# EAGLE design Easycheck_rev2_chip (EAGLE 9.4.0)
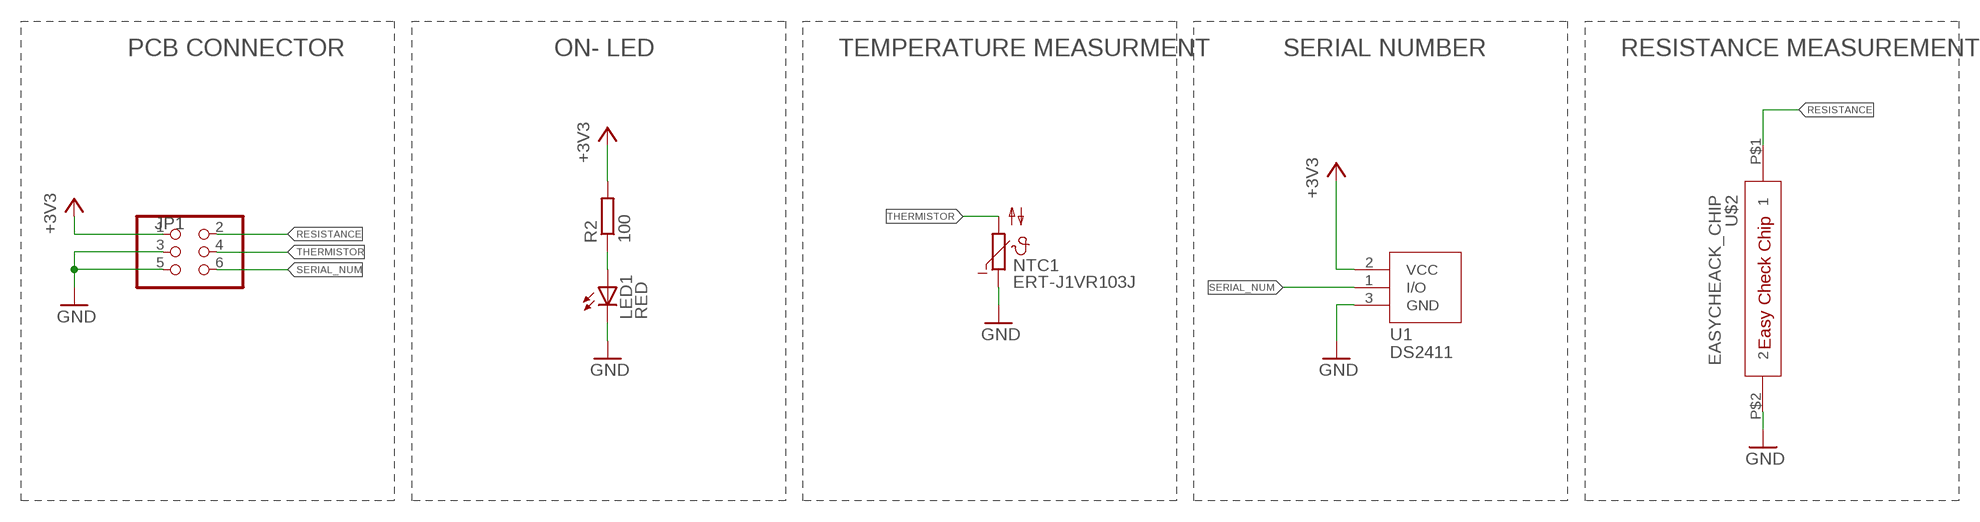
[diagram p0: schematic, sheet 1]

## Parts
JP1  PINHD-2X3  [2X03]
LED1  RED  LEDCHIPLED_0603  [CHIPLED_0603]
NTC1  ERT-J1VR103J  NTC_SMD  [C0603K]
R2  100  R-EU_R0402  [R0402]
U1  DS2411  [SOT23]
U$2  EASYCHEACK_CHIP  [EASYCHECK_CHIP]

## Nets
+3V3: JP1.1 R2.2 U1.2(VCC)
GND: JP1.3 JP1.5 LED1.C NTC1.1 U1.3(GND) U$2.P$2
N$2: LED1.A R2.1
RESISTANCE: JP1.2 U$2.P$1
SERIAL_NUM: JP1.6 U1.1(I/O)
THERMISTOR: JP1.4 NTC1.2

## Notes on the sheet
- PCB CONNECTOR | ON- LED | TEMPERATURE MEASURMENT | SERIAL NUMBER | RESISTANCE MEASUREMENT

## Library data of the parts
JP1 = pinhead:PINHD-2X3: PIN HEADER
LED1 = led:LED: LED OSRAM: - CHIPLED LG R971, LG N971, LY N971, LG Q971, LY Q971, LO R971, LY R971 LH N974, LH R974 LS Q976, LO Q976, LY Q976 LO Q996 - Hyper CHIPLED LW Q18S LB Q993, LB Q99A, LB R99A - SideLED LS A670, LO A670, LY A670, LG A670, LP A670 LB A673, LV A673, LT A673, LW A673 LH A674 LY A675 LS A676, LA A676, LO A676, LY A676, LW A676 LS A679, LY A679, LG A679 - Hyper Micro SIDELED® LS Y876, LA Y876, LO Y876, LY Y876 LT Y87S - SmartLED LW L88C, LW L88S LB L89C, LB L89S, LG L890 LS L89K, LO L89K, LY L89K LS L896, LA L896, LO L896, LY L896 - TOPLED LS T670, LO T670, LY T670, LG T670, LP T670 LSG T670, LSP T670, LSY T670, LOP T670, LYG T670 LG T671, LOG T671, LSG T671 LB T673, LV T673, LT T673, LW T673 LH T674 LS T676, LA T676, LO T676, LY T676, LB T676, LH T676, LSB T676, LW T676 LB T67C, LV T67C, LT T67C, LS T67K, LO T67K, LY T67K, LW E67C LS E67B, LA E67B, LO E67B, LY E67B, LB E67C, LV E67C, LT E67C LW T67C LS T679, LY T679, LG T679 LS T770, LO T770, LY T770, LG T770, LP T770 LB T773, LV T773, LT T773, LW T773 LH T774 LS E675, LA E675, LY E675, LS T675 LS T776, LA T776, LO T776, LY T776, LB T776 LHGB T686 LT T68C, LB T68C - Hyper Mini TOPLED® LB M676 - Mini TOPLED Santana® LG M470 LS M47K, LO M47K, LY M47K Source: http://www.osram.convergy.de LUXEON: - LUMILED® LXK2-PW12-R00, LXK2-PW12-S00, LXK2-PW14-U00, LXK2-PW14-V00 LXK2-PM12-R00, LXK2-PM12-S00, LXK2-PM14-U00 LXK2-PE12-Q00, LXK2-PE12-R00, LXK2-PE12-S00, LXK2-PE14-T00, LXK2-PE14-U00 LXK2-PB12-K00, LXK2-PB12-L00, LXK2-PB12-M00, LXK2-PB14-N00, LXK2-PB14-P00, LXK2-PB14-Q00 LXK2-PR12-L00, LXK2-PR12-M00, LXK2-PR14-Q00, LXK2-PR14-R00 LXK2-PD12-Q00, LXK2-PD12-R00, LXK2-PD12-S00 LXK2-PH12-R00, LXK2-PH12-S00 LXK2-PL12-P00, LXK2-PL12-Q00, LXK2-PL12-R00 Source: www.luxeon.com KINGBRIGHT: KA-3528ASYC Source: www.kingbright.com
NTC1 = EasyCheck:NTC_SMD
R2 = rcl:R-EU_: RESISTOR, European symbol; SPICEPREFIX: R
U1 = EasyCheck:DS2411
U$2 = EasyCheck:EASYCHEACK_CHIP

## Board
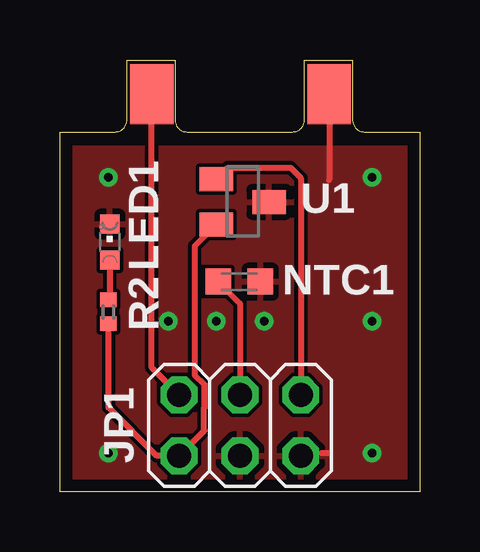
[diagram p1: board, top side]
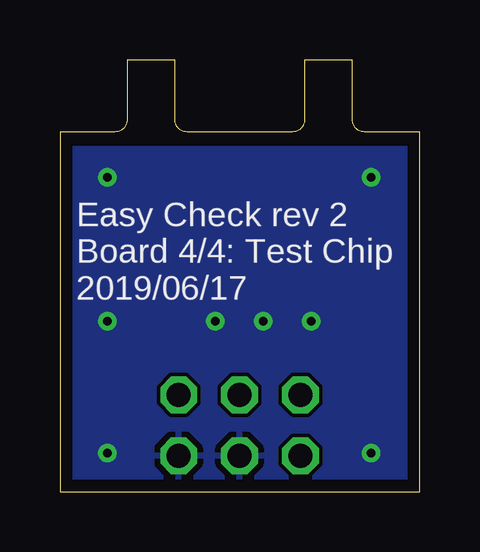
[diagram p2: board, bottom side, seen from below]

Size 15 x 18 mm. Coordinates in mm from the lower left corner, seen from the top.
Outline: 12.2,18 12.2,15.5
Outline: 12.2,15.5 arc90 12.7,15
Outline: 12.7,15 15,15
Outline: 15,15 15,0
Outline: 15,0 0,0
Outline: 0,0 0,15
Outline: 0,15 2.3,15
Outline: 2.3,15 arc90 2.8,15.5
Outline: 2.8,15.5 2.8,18
Outline: 2.8,18 4.8,18
Outline: 4.8,18 4.8,15.5
Outline: 4.8,15.5 arc90 5.3,15
Outline: 5.3,15 9.7,15
Outline: 9.7,15 arc90 10.2,15.5
Outline: 10.2,15.5 10.2,18
Outline: 10.2,18 12.2,18
Outline: 12.2,18 12.2,15.5
Outline: 12.2,15.5 arc90 12.7,15
Outline: 12.7,15 15,15
Outline: 15,15 15,0
Outline: 15,0 0,0
Outline: 0,0 0,15
Outline: 0,15 2.3,15
Outline: 2.3,15 arc90 2.8,15.5
Outline: 2.8,15.5 2.8,18
Outline: 2.8,18 4.8,18
Outline: 4.8,18 4.8,15.5
Outline: 4.8,15.5 arc90 5.3,15
Outline: 5.3,15 9.7,15
Outline: 9.7,15 arc90 10.2,15.5
Outline: 10.2,15.5 10.2,18
Outline: 10.2,18 12.2,18
Copper layers (1*16): Top 0.035mm / dielectric 1.5mm / Bottom 0.035mm
Design rules "default": minimum track width 6mil, minimum drill 0.35mm, track to track 6mil, track to pad 6mil, pad to pad 6mil, via to via 6mil, smd to smd 6mil, copper to edge 20mil, drill to drill 6mil, minimum pad ring 10mil, minimum via ring 8mil, stop-mask expansion 4mil, vias tented up to drill 0.4mm, thermal gap 10mil

### Footprints (pad centres in the part's own frame; a part is rotated, then mirrored left to right if it is on the bottom)
2X03 = drill 1.016 octagon: 1 -2.54,-1.27; 2 -2.54,1.27; 3 0,-1.27; 4 0,1.27; 5 2.54,-1.27; 6 2.54,1.27
CHIPLED_0603 = smd 0.8 x 0.8: A 0,-0.75; C 0,0.75
C0603K = smd 1.05 x 1.08: 1 -0.875,0; 2 0.875,0
R0402 = smd 0.6 x 0.7: 1 -0.5,0; 2 0.5,0
SOT23 = smd 1 x 1.4: 1 -0.95,-1.1; 2 0.95,-1.1; 3 0,1.1
EASYCHECK_CHIP = smd 1.8 x 2.5: P$1 -3.7,0; P$2 3.7,0

### Placement (x,y rotation side)
JP1  7.51,2.76 0 top
LED1  2.08,10.4 0 top
NTC1  7.48,8.75 180 top
R2  2.02,7.49 270 top
U1  7.62,12.08 270 top
U$2  7.53,16.57 0 top

### Tracks (layer width: path | path; a pad name or v marks a point on that pad's centre or on a via)
+3V3
  Top 0.254: U1.2 5.62,10.23 5.62,4.85 6.01,4.46 6.01,3.5 6.01,2.53 JP1.1 4.03,1.49 2.02,3.5 R2.2
GND  (via drill 0.35)
  Top 0.254: 11.23,1.6 10.92,1.6 | U$2.P$2 11.23,13
  other vias: 2.02,13.1 13.02,13.1 2.02,1.6 13.02,1.6 13.02,7.1 6.52,7.1 4.52,7.1 8.52,7.1
  pour Top: -0.48,14.3 -0.48,-0.6 15.52,-0.6 15.52,14.3
  pour Bottom: -0.48,14.3 -0.48,-0.6 15.52,-0.6 15.52,14.3
N$2
  Top 0.254: LED1.A 2.08,8.05 R2.1
RESISTANCE
  Top 0.254: JP1.2 3.83,5.17 U$2.P$1
SERIAL_NUM
  Top 0.254: U1.1 6.99,13.5 9.62,13.5 10.05,13.07 JP1.6
THERMISTOR
  Top 0.254: NTC1.2 7.51,7.85 JP1.4

### Text on the board
bPlace: Easy Check rev 2 / Board 4/4: Test Chip / 2019/06/17